# Altium project DARKYDEN.PrjPcb (part 13 of 14)

## Sheet USB2_0_Connector.SchDoc: DARKYDEN_USBC2_0_Connector
size Letter; ApprovedBy: APPROUVÉ PAR; Author: Harold Malbrouck; Organization: Cegep Limoilou; Address1: 1300, 8e Avenue; Address2: Québec, QC; Address3: Canada; Address4: G1J 5L5; Revision: Rev.C; SheetNumber: 22; SheetTotal: 22
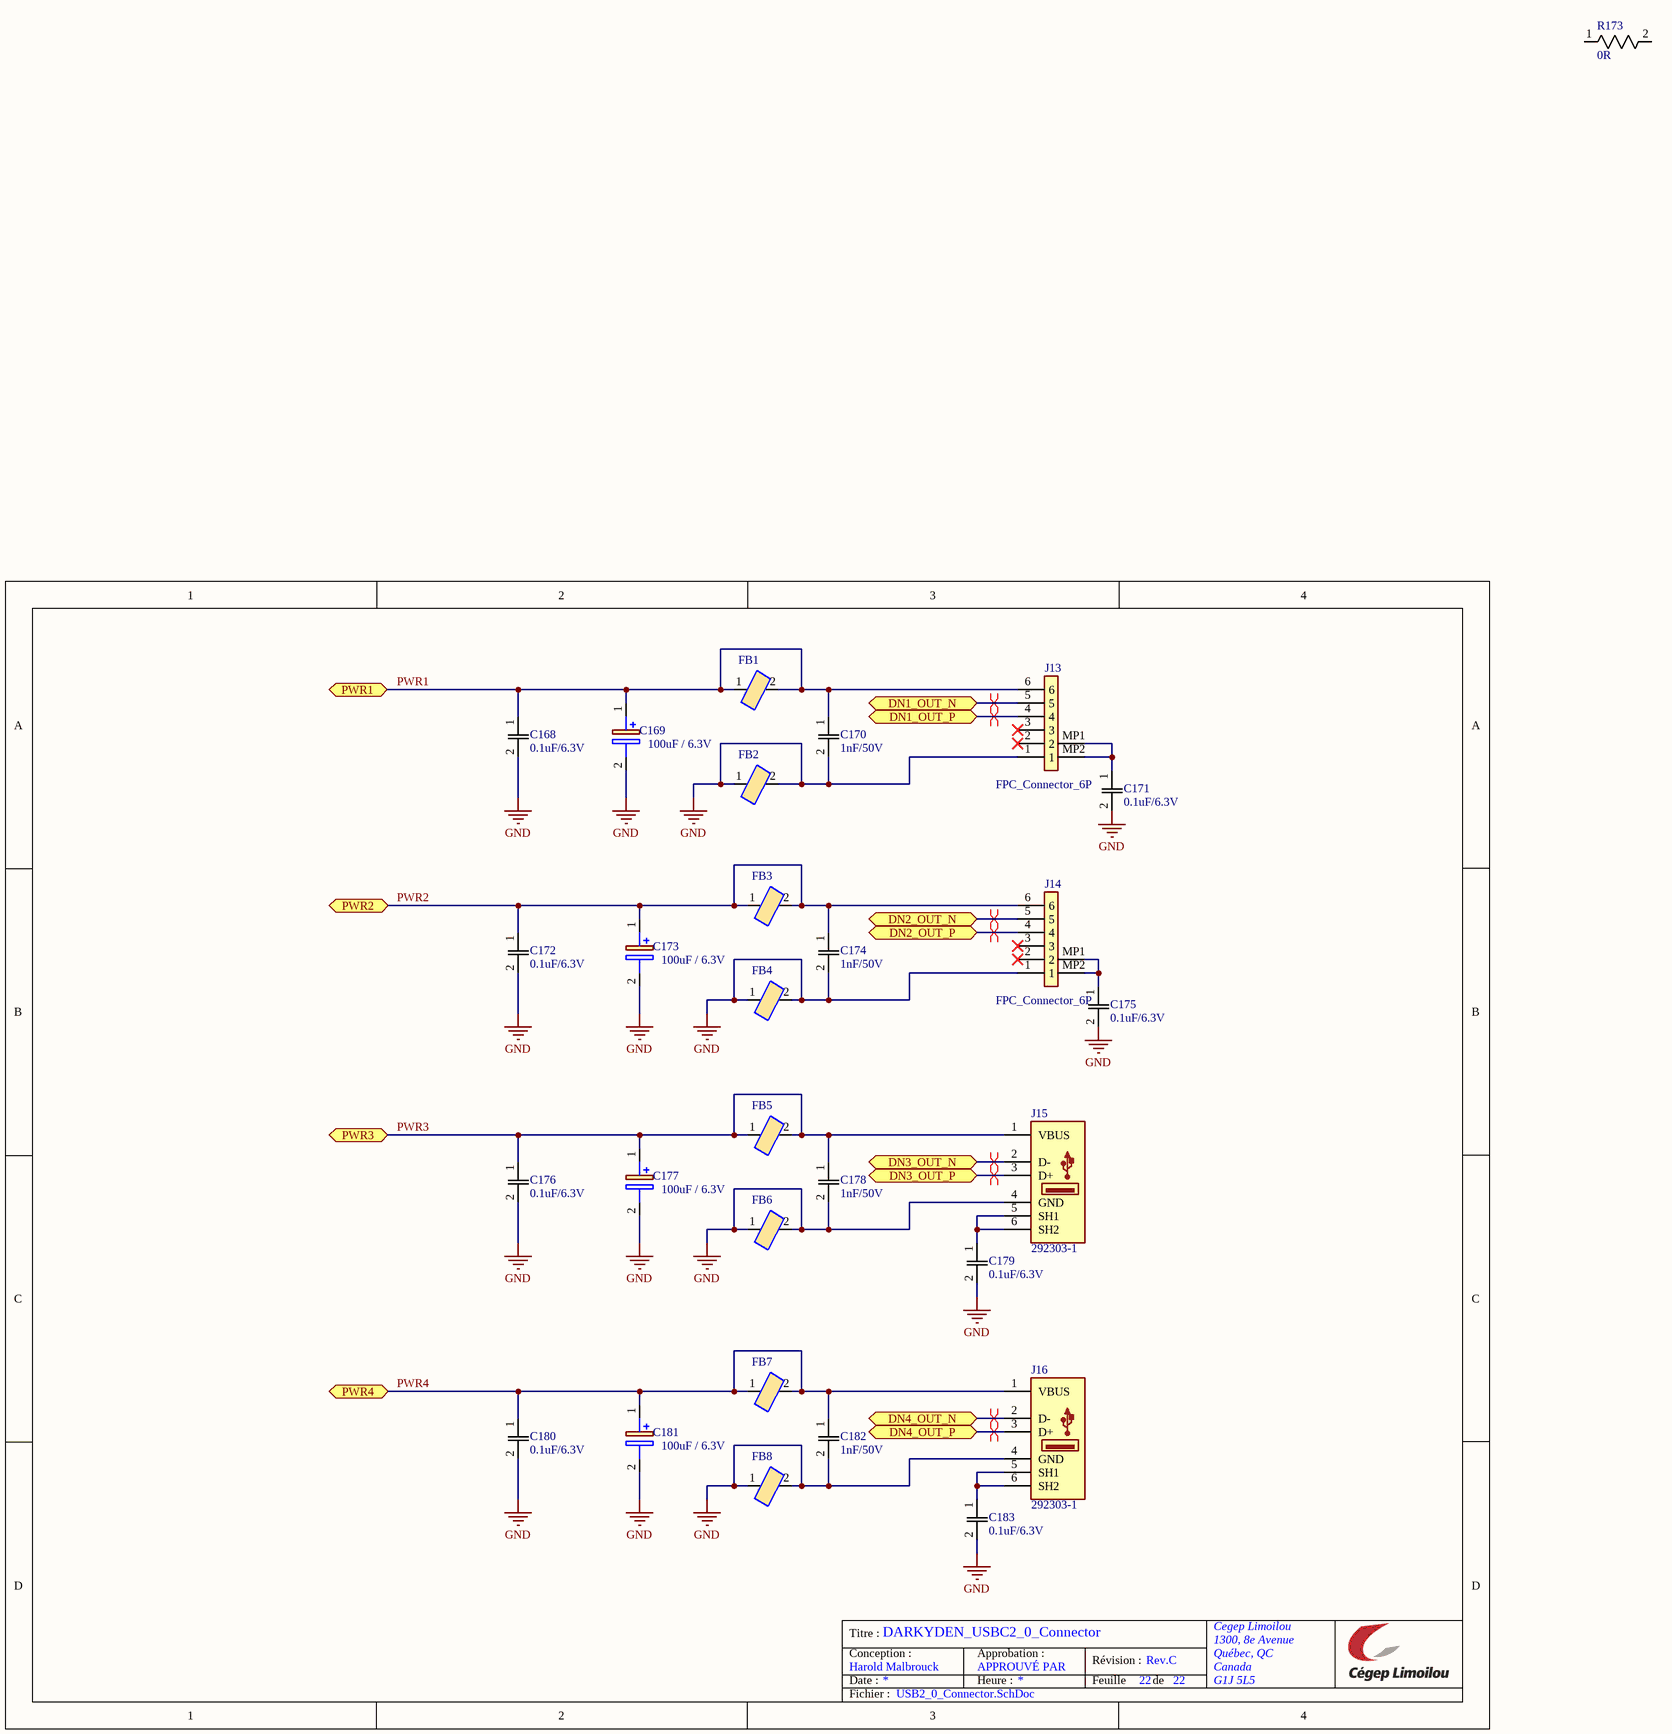
[diagram p14: USB2_0_Connector.SchDoc]

### Parts
C168  0.1uF/6.3V  [C0805]
C169  100uF / 6.3V  [EEE0GA101SR]
C170  1nF/50V  [CAPC2012X88N]
C171  0.1uF/6.3V  [C0805]
C172  0.1uF/6.3V  [C0805]
C173  100uF / 6.3V  [EEE0GA101SR]
C174  1nF/50V  [CAPC2012X88N]
C175  0.1uF/6.3V  [C0805]
C176  0.1uF/6.3V  [C0805]
C177  100uF / 6.3V  [EEE0GA101SR]
C178  1nF/50V  [CAPC2012X88N]
C179  0.1uF/6.3V  [C0805]
C180  0.1uF/6.3V  [C0805]
C181  100uF / 6.3V  [EEE0GA101SR]
C182  1nF/50V  [CAPC2012X88N]
C183  0.1uF/6.3V  [C0805]
FB1  220R / 100MHz  [BLM18SP221SN1B]  (value not drawn)
FB2  220R / 100MHz  [BLM18SP221SN1B]  (value not drawn)
FB3  220R / 100MHz  [BLM18SP221SN1B]  (value not drawn)
FB4  220R / 100MHz  [BLM18SP221SN1B]  (value not drawn)
FB5  220R / 100MHz  [BLM18SP221SN1B]  (value not drawn)
FB6  220R / 100MHz  [BLM18SP221SN1B]  (value not drawn)
FB7  220R / 100MHz  [BLM18SP221SN1B]  (value not drawn)
FB8  220R / 100MHz  [BLM18SP221SN1B]  (value not drawn)
J13  FPC_Connector_6P  [23287026]
J14  FPC_Connector_6P  [23287026]
J15  292303-1  [TECONN-4POS-USB]
J16  292303-1  [TECONN-4POS-USB]
R173  0R  [ERJ3EKF1000V]

### Ports
DN1_OUT_N (bidir, see USB2_0[3C]), DN1_OUT_P (bidir, see USB2_0[3C]), DN2_OUT_N (bidir, see USB2_0[4C]), DN2_OUT_P (bidir, see USB2_0[4C]), DN3_OUT_N (bidir, see USB2_0[2D]), DN3_OUT_P (bidir, see USB2_0[2D]), DN4_OUT_N (bidir, see USB2_0[3D]), DN4_OUT_P (bidir, see USB2_0[3D]), PWR1 (bidir, see USB2_0[2C]), PWR2 (bidir, see USB2_0[3C]), PWR3 (bidir, see USB2_0[1D]), PWR4 (bidir, see USB2_0[3D])

### Nets
GND: C168.2 C169.2(-) C170.2 C171.2 C172.2 C173.2(-) C174.2 C175.2 C176.2 C177.2(-) C178.2 C179.2 C180.2 C181.2(-) C182.2 C183.2 FB2.1 FB2.2 FB4.1 FB4.2 FB6.1 FB6.2 FB8.1 FB8.2 J13.1 J14.1 J15.4(GND) J16.4(GND)  [project net PACK-]
DN1_OUT_N: J13.5 ; port DN1_OUT_N
DN1_OUT_P: J13.4 ; port DN1_OUT_P
DN2_OUT_N: J14.5 ; port DN2_OUT_N
DN2_OUT_P: J14.4 ; port DN2_OUT_P
DN3_OUT_N: J15.2(D-) ; port DN3_OUT_N
DN3_OUT_P: J15.3(D+) ; port DN3_OUT_P
DN4_OUT_N: J16.2(D-) ; port DN4_OUT_N
DN4_OUT_P: J16.3(D+) ; port DN4_OUT_P
PWR1: C168.1 C169.1(+) C170.1 FB1.1 FB1.2 J13.6 ; port PWR1
PWR2: C172.1 C173.1(+) C174.1 FB3.1 FB3.2 J14.6 ; port PWR2
PWR3: C176.1 C177.1(+) C178.1 FB5.1 FB5.2 J15.1(VBUS) ; port PWR3
PWR4: C180.1 C181.1(+) C182.1 FB7.1 FB7.2 J16.1(VBUS) ; port PWR4
NetC171_1: C171.1 J13.MP1 J13.MP2
NetC175_1: C175.1 J14.MP1 J14.MP2
NetC179_1: C179.1 J15.5(SH1) J15.6(SH2)
NetC183_1: C183.1 J16.5(SH1) J16.6(SH2)

Not connected (* = marked no-connect by the designer): J13 2* 3*; J14 2* 3*; R173 1 2

### Layout directives
differential pair: DN1_OUT_N, DN1_OUT_P, DN2_OUT_N, DN2_OUT_P, DN3_OUT_N, DN3_OUT_P, DN4_OUT_N, DN4_OUT_P

### Notes on the sheet
- Titre :
- Conception :
- Date :
- Approbation :
- Heure :
- Révision :
- Feuille
- de
- Fichier :

### Library data of the parts
C168 C171 C172 C175 C176 C179 C180 C183 = C0805C104K9RACTU: as C156 on sheet USB2_0; Datasheet Link: https://content.kemet.com/datasheets/KEM_C1002_X7R_SMD.pdf; Height: 1.1mm; Manufacturer_Part_Number: C0805C104K9RACTU; Mouser Part Number: 80-C0805C104K9R; Mouser Price/Stock: https://www.mouser.co.uk/ProductDetail/KEMET/C0805C104K9RACTU?qs=jbCUrP3sAgRYLjBU7s5h8Q%3D%3D; Arrow Part Number: C0805C104K9RACTU; Arrow Price/Stock: https://www.arrow.com/en/products/c0805c104k9ractu/kemet-corporation; Supplier: Digikey; Supplier Part Number: 399-C0805C104K9RACTUCT-ND; Manufacturer: KEMET; Manufacturer Part Number: C0805C104K9RACTU; RoHS: Yes; Category: Ceramic Capacitors; Stock: 68008; Pricing: 1=0.21, 10=0.214, 100=0.1506, 1000=0.11154 (USD); Mounting Technology: Surface Mount; Case/Package: 0805; Case Code (Metric): 2012; Case Code (Imperial): 0805; Min Operating Temperature: -55°C; Max Operating Temperature: 125°C; Package Quantity: 4000; Voltage Rating: 6.3V; Tolerance: 10%; Packaging: Tape and Reel; Voltage Rating (DC): 6.3V; Dielectric: X7R; Termination: SMD/SMT; Series: SMD Comm X7R; Construction: Flat; Length: 2mm; Width: 1.2mm; Thickness: 0.039inch; Depth: 1.25mm; Radiation Hardening: No; RoHS Compliant: Yes; ComponentLink1URL: http://www.farnell.com/datasheets/2746329.pdf?src-supplier=Farnell; ComponentLink1Description: http://www.farnell.com/datasheets/2746329.pdf?src-supplier=Farnell; ComponentLink2URL: http://www.mouser.com/ds/2/212/KEM_C1002_X7R_SMD-1102033.pdf?src-supplier=Mouser; ComponentLink2Description: http://www.mouser.com/ds/2/212/KEM_C1002_X7R_SMD-1102033.pdf?src-supplier=Mouser; ComponentLink3URL: http://datasheet.octopart.com/C0805C104K9RACTU-KEMET-datasheet-157246124.pdf?src-supplier=Avnet; ComponentLink3Description: http://datasheet.octopart.com/C0805C104K9RACTU-KEMET-datasheet-157246124.pdf?src-supplier=Avnet; ComponentLink4URL: http://datasheet.octopart.com/C0805C104K9RACTU-KEMET-datasheet-157246124.pdf?src-supplier=Onlinecomponents.com; ComponentLink4Description: http://datasheet.octopart.com/C0805C104K9RACTU-KEMET-datasheet-157246124.pdf?src-supplier=Onlinecomponents.com; ComponentLink5URL: http://capacitoredge.kemet.com/capedge2/DataSheet?pn=C0805C104K9RACTU&src-supplier=Avnet; ComponentLink5Description: http://capacitoredge.kemet.com/capedge2/DataSheet?pn=C0805C104K9RACTU&src-supplier=Avnet; ComponentLink6URL: http://www.farnell.com/datasheets/2746329.pdf?src-supplier=Newark; ComponentLink6Description: http://www.farnell.com/datasheets/2746329.pdf?src-supplier=Newark; ComponentLink7URL: http://datasheet.octopart.com/C0805C104K9RACTU-KEMET-datasheet-157246124.pdf?src-supplier=Digikey; ComponentLink7Description: http://datasheet.octopart.com/C0805C104K9RACTU-KEMET-datasheet-157246124.pdf?src-supplier=Digikey; ComponentLink8URL: https://api.kemet.com/component-edge/download/datasheet/C0805C104K9RACTU.pdf?src-supplier=Digikey; ComponentLink8Description: https://api.kemet.com/component-edge/download/datasheet/C0805C104K9RACTU.pdf?src-supplier=Digikey; ComponentLink9URL: https://datasheet.octopart.com/C0805C104K9RACTU.-KEMET-datasheet-179056791.pdf?src-supplier=Element14; ComponentLink9Description: https://datasheet.octopart.com/C0805C104K9RACTU.-KEMET-datasheet-179056791.pdf?src-supplier=Element14; ComponentLink10URL: https://datasheet.octopart.com/C0805C104K9RACTU-KEMET-datasheet-137357759.pdf?src-supplier=Farnell; ComponentLink10Description: https://datasheet.octopart.com/C0805C104K9RACTU-KEMET-datasheet-137357759.pdf?src-supplier=Farnell; ComponentLink11URL: http://www.farnell.com/datasheets/2746329.pdf?src-supplier=Element14; ComponentLink11Description: http://www.farnell.com/datasheets/2746329.pdf?src-supplier=Element14; ComponentLink12URL: https://datasheet.octopart.com/C0805C104K9RACTU-KEMET-datasheet-157246124.pdf?src-supplier=TME; ComponentLink12Description: https://datasheet.octopart.com/C0805C104K9RACTU-KEMET-datasheet-157246124.pdf?src-supplier=TME; ComponentLink13URL: http://datasheet.octopart.com/C0805C104K9RACTU-KEMET-datasheet-157246124.pdf?src-supplier=TTI; ComponentLink13Description: http://datasheet.octopart.com/C0805C104K9RACTU-KEMET-datasheet-157246124.pdf?src-supplier=TTI; ComponentLink14URL: http://datasheet.octopart.com/C0805C104K9RACTU-KEMET-datasheet-157246124.pdf?src-supplier=Electro+Sonic; ComponentLink14Description: http://datasheet.octopart.com/C0805C104K9RACTU-KEMET-datasheet-157246124.pdf?src-supplier=Electro+Sonic
C169 C173 C177 C181 = EEE-FPJ101UAR: 100uF 6.3V 20% Cap Aluminum Lytic  SMD 0.36 Ohm 240mA 2000h 105C Automotive T/R; Manufacturer_Name: Panasonic; Material: Aluminium; ESR (Equivalent Series Resistance): 360mR; Life (Hours): 2000Hour; Leakage Current: 6.3uA; Datasheet Link: http://industrial.panasonic.com/cdbs/www-data/pdf/RDE0000/ABA0000C1184.pdf; Height: 6.5mm; Manufacturer_Part_Number: EEE-FPJ101UAR; Mouser Part Number: 667-EEE-FPJ101UAR; Mouser Price/Stock: https://www.mouser.co.uk/ProductDetail/Panasonic/EEE-FPJ101UAR?qs=d1CqaRUMZD%252BxJy4M83vA9g%3D%3D; Arrow Part Number: EEE-FPJ101UAR; Arrow Price/Stock: https://www.arrow.com/en/products/eee-fpj101uar/panasonic?utm_currency=USD&region=europe; Supplier: Digikey; Supplier Part Number: PCE4514CT-ND; Manufacturer: Panasonic; Manufacturer Part Number: EEE-FPJ101UAR; RoHS: Yes; Category: Aluminum Electrolytic Capacitors; Stock: 28785; Pricing: 1=0.56, 10=0.35, 50=0.2602, 100=0.2317, 500=0.18256 (USD); Mounting Technology: Surface Mount,PCB; Case/Package: Radial; Dielectric Material: Aluminium; Min Operating Temperature: -55°C; Max Operating Temperature: 105°C; Value: 100uF; Packaging: Tape and Reel; Voltage Rating (DC): 6.3V; Package Quantity: 1; Termination: SMD/SMT; Series: FP; Ripple Current: 240mA; Tolerance: 20%; Voltage Rating: 6.3V; Ripple Current (AC): 240mA; Voltage: 6.3V; Construction: Cylindrical; Diameter: 5mm; Length: 6.1mm; Lead Pitch: 1.5mm; Height - Seated (Max): 0.228inch; Radiation Hardening: No; Lead Free: Lead Free; RoHS Compliant: Yes; Reach SVHC Compliant: Unknown; ComponentLink1URL: https://datasheet.ciiva.com/11777/0900766b80df09a1-11777260.pdf?src-supplier=Rs; ComponentLink1Description: https://datasheet.ciiva.com/11777/0900766b80df09a1-11777260.pdf?src-supplier=Rs; ComponentLink2URL: https://datasheet.ciiva.com/25614/0900766b80df09a1-25614042.pdf?src-supplier=Rs; ComponentLink2Description: https://datasheet.ciiva.com/25614/0900766b80df09a1-25614042.pdf?src-supplier=Rs; ComponentLink3URL: https://datasheet.ciiva.com/2985/aba0000ce114-2985560.pdf?src-supplier=Avnet; ComponentLink3Description: https://datasheet.ciiva.com/2985/aba0000ce114-2985560.pdf?src-supplier=Avnet; ComponentLink4URL: https://datasheet.ciiva.com/30259/aba0000ce114-30259452.pdf?src-supplier=Onlinecomponents.com; ComponentLink4Description: https://datasheet.ciiva.com/30259/aba0000ce114-30259452.pdf?src-supplier=Onlinecomponents.com; ComponentLink5URL: https://datasheet.ciiva.com/14597/70068195-14597061.pdf?src-supplier=Allied+Electronics; ComponentLink5Description: https://datasheet.ciiva.com/14597/70068195-14597061.pdf?src-supplier=Allied+Electronics; ComponentLink6URL: https://datasheet.ciiva.com/14606/70068195-14606383.pdf?src-supplier=Allied+Electronics; ComponentLink6Description: https://datasheet.ciiva.com/14606/70068195-14606383.pdf?src-supplier=Allied+Electronics; ComponentLink7URL: https://datasheet.ciiva.com/48523/fp-eng-tds-48523719.pdf?src-supplier=Distrelec; ComponentLink7Description: https://datasheet.ciiva.com/48523/fp-eng-tds-48523719.pdf?src-supplier=Distrelec; ComponentLink8URL: https://datasheet.ciiva.com/46391/370232-46391160.pdf?src-supplier=Element14; ComponentLink8Description: https://datasheet.ciiva.com/46391/370232-46391160.pdf?src-supplier=Element14; ComponentLink9URL: https://datasheet.ciiva.com/46398/370232-46398005.pdf?src-supplier=Element14; ComponentLink9Description: https://datasheet.ciiva.com/46398/370232-46398005.pdf?src-supplier=Element14
C170 C174 C178 C182 = C0805C102K5RAC-TU: 1000 pF ±10% 50V Ceramic Capacitor X7R 0805 (2012 Metric); Manufacturer_Name: KEMET; Datasheet Link: https://componentsearchengine.com/Datasheets/2/C0805C102K5RAC-TU.pdf; Height: 0.88mm; Manufacturer_Part_Number: C0805C102K5RAC-TU
FB1-FB8 = BLM18EG221SN1D: Ferrite Beads Multi-Layer 220Ohm 25% 100MHz 2A 50mOhm DCR 0603 Paper T/R; Manufacturer_Name: Murata Electronics; Manufacturer: Murata; Material: Steel,Ferrite; Value: 50mR; Number of Lines: 1; Number of Circuits: 1NUMBER; Datasheet Link: http://www.murata.com/~/media/webrenewal/support/library/catalog/products/emc/emifil/c31e.ashx?la=en-gb; Height: 0.95mm; Manufacturer_Part_Number: BLM18EG221SN1D; Mouser Part Number: 81-BLM18EG221SN1D; Mouser Price/Stock: https://www.mouser.co.uk/ProductDetail/Murata-Electronics/BLM18EG221SN1D?qs=uSeJpk%2F8In2DDeSj2a4KGA%3D%3D; Arrow Part Number: BLM18EG221SN1D; Arrow Price/Stock: https://www.arrow.com/en/products/blm18eg221sn1d/murata-manufacturing?utm_currency=USD&region=nac; Supplier: Digikey; Supplier Part Number: 490-3992-1-ND; Manufacturer Part Number: BLM18EG221SN1D; RoHS: Yes; Category: Ferrite Beads and Chips; Stock: 133283; Pricing: 1=0.24, 10=0.167, 25=0.1444, 50=0.1292, 100=0.1154, 250=0.09864, 500=0.08708, 1000=0.07636 (USD); Case/Package: 0603; Pins: 2; Core Material: Ferrite; Case Code (Metric): 1608; Case Code (Imperial): 0603; Min Operating Temperature: -55°C; Max Operating Temperature: 125°C; Tolerance: 25%; Impedance: 220R; Package Quantity: 1; Packaging: Tape and Reel; Current Rating: 2A; Max Current Rating: 2A; DC Resistance (DCR): 50mR; Max DC Current: 2A; Termination: SMD/SMT; Test Frequency: 100MHz; DC Current: 2A; Series: BLM18E; DC Resistance-Max: 50mR; RMS Current (Irms): 2A; ESR: 50mR; Frequency: 100MHz; Length: 1.6mm; Width: 0.8mm; Depth: 0.8mm; Radiation Hardening: No; Reach SVHC Compliant: No; Military Standard: Not; Lead Free: Lead Free; RoHS Compliant: Yes; ComponentLink1URL: https://datasheet.ciiva.com/11799/0900766b811b5866-11799010.pdf?src-supplier=Rs; ComponentLink1Description: https://datasheet.ciiva.com/11799/0900766b811b5866-11799010.pdf?src-supplier=Rs; ComponentLink2URL: https://datasheet.ciiva.com/41449/001171699-da-01-en-chip-drossel0603-220r-2000ma-1-6x0-8mm-41449376.pdf?src-supplier=Conrad; ComponentLink2Description: https://datasheet.ciiva.com/41449/001171699-da-01-en-chip-drossel0603-220r-2000ma-1-6x0-8mm-41449376.pdf?src-supplier=Conrad; ComponentLink3URL: https://datasheet.ciiva.com/41449/001172265-da-01-en-drossel-0603-220r-1-6x0-8mm-4000st-41449579.pdf?src-supplier=Conrad; ComponentLink3Description: https://datasheet.ciiva.com/41449/001172265-da-01-en-drossel-0603-220r-1-6x0-8mm-4000st-41449579.pdf?src-supplier=Conrad; ComponentLink4URL: https://datasheet.ciiva.com/1012/l0110s0101blm18e-1012872.pdf?src-supplier=Digikey; ComponentLink4Description: https://datasheet.ciiva.com/1012/l0110s0101blm18e-1012872.pdf?src-supplier=Digikey; ComponentLink5URL: https://datasheet.ciiva.com/1012/l0110s0101blm18e-1012873.pdf?src-supplier=Digikey; ComponentLink5Description: https://datasheet.ciiva.com/1012/l0110s0101blm18e-1012873.pdf?src-supplier=Digikey; ComponentLink6URL: https://datasheet.ciiva.com/1012/l0110s0101blm18e-1012874.pdf?src-supplier=Digikey; ComponentLink6Description: https://datasheet.ciiva.com/1012/l0110s0101blm18e-1012874.pdf?src-supplier=Digikey; ComponentLink7URL: https://datasheet.ciiva.com/14122/blm-series-eng-tds-14122908.pdf?src-supplier=Distrelec; ComponentLink7Description: https://datasheet.ciiva.com/14122/blm-series-eng-tds-14122908.pdf?src-supplier=Distrelec; ComponentLink8URL: https://datasheet.ciiva.com/1467/5169-1467157.pdf?src-supplier=Element14; ComponentLink8Description: https://datasheet.ciiva.com/1467/5169-1467157.pdf?src-supplier=Element14; ComponentLink9URL: https://datasheet.ciiva.com/1467/5169-1467158.pdf?src-supplier=Element14; ComponentLink9Description: https://datasheet.ciiva.com/1467/5169-1467158.pdf?src-supplier=Element14; ComponentLink10URL: https://datasheet.ciiva.com/8510/l0110s0101blm18e-8510140.pdf?src-supplier=Avnet; ComponentLink10Description: https://datasheet.ciiva.com/8510/l0110s0101blm18e-8510140.pdf?src-supplier=Avnet; ComponentLink11URL: https://datasheet.ciiva.com/16419/l0110s0101blm18e-16419148.pdf?src-supplier=Future+Electronics; ComponentLink11Description: https://datasheet.ciiva.com/16419/l0110s0101blm18e-16419148.pdf?src-supplier=Future+Electronics
J13 J14 = 2328702-6: FPC Connector; 0.5mm pitch dual contact back flip FPC, 6pos | TE Connectivity 2328702-6; Actuator Material: Thermoplastic; Actuator Color: Black; Number of Positions: 6; Voltage Rating: 50V; Current Rating: 500mA; Value: 7.6pF; Datasheet Link: https://www.te.com/commerce/DocumentDelivery/DDEController?Action=srchrtrv&DocNm=1-1773959-7-FPC-Connectors-CN&DocType=Data%20Sheet&DocLang=Chinese (Simplified)&PartCntxt=2328702-6&DocFormat=pdf; Height: 1.1mm; Manufacturer_Name: TE Connectivity; Manufacturer_Part_Number: 2328702-6; Mouser Part Number: 571-2328702-6; Mouser Price/Stock: https://www.mouser.co.uk/ProductDetail/TE-Connectivity/2328702-6?qs=w%2Fv1CP2dgqrAQsCHQ2ClBQ%3D%3D; Arrow Part Number: 2328702-6; Arrow Price/Stock: https://www.arrow.com/en/products/2328702-6/te-connectivity?utm_currency=USD&region=nac; Supplier: Digikey; Supplier Part Number: A141388CT-ND; Manufacturer: TE Connectivity; Manufacturer Part Number: 2328702-6; RoHS: Yes; Category: FFC / FPC; Stock: 48490; Pricing: 1=0.19, 10=0.162, 25=0.1512, 50=0.144, 100=0.1372, 250=0.12856, 500=0.12242, 1000=0.11657 (USD); Mounting Technology: Surface Mount; Case/Package: 0402; Contact Material: Copper Alloy; Contact Plating: Gold; Housing Material: Thermoplastic; Housing Color: Natural; Min Operating Temperature: -40°C; Max Operating Temperature: 85°C; Packaging: Cut Tape; Termination: Solder; Series: -; Ratings: AEC-Q200; Flammability Rating: UL94 V-0; ComponentLink1URL: https://www.te.com/commerce/DocumentDelivery/DDEController?Action=srchrtrv&amp;DocNm=2328702&amp;DocType=Customer+Drawing&amp;DocLang=English&src-supplier=Digikey; ComponentLink1Description: https://www.te.com/commerce/DocumentDelivery/DDEController?Action=srchrtrv&amp;DocNm=2328702&amp;DocType=Customer+Drawing&amp;DocLang=English&src-supplier=Digikey; ComponentLink2URL: https://www.te.com/commerce/DocumentDelivery/DDEController?Action=srchrtrv&DocNm=2328702&DocType=Customer+Drawing&DocLang=English&src-supplier=Digikey; ComponentLink2Description: https://www.te.com/commerce/DocumentDelivery/DDEController?Action=srchrtrv&DocNm=2328702&DocType=Customer+Drawing&DocLang=English&src-supplier=Digikey; ComponentLink3URL: https://datasheet.octopart.com/2328702-6-TE-Connectivity-datasheet-137167967.pdf?src-supplier=Electro+Sonic; ComponentLink3Description: https://datasheet.octopart.com/2328702-6-TE-Connectivity-datasheet-137167967.pdf?src-supplier=Electro+Sonic
J15 J16 = 292303-1: USB-A (USB TYPE-A) USB 2.0 Receptacle Connector 4 Position Through Hole, Right Angle; Manufacturer_Name: TE Connectivity; Datasheet Link: https://datasheet.datasheetarchive.com/originals/distributors/Datasheets_SAMA/3e4c4de204b167d1a9250e6de251b7b8.pdf; Manufacturer_Part_Number: 292303-1; Mouser Part Number: 571-292303-1; Mouser Price/Stock: https://www.mouser.co.uk/ProductDetail/TE-Connectivity/292303-1?qs=G%2F5vCLrg9vx2OsUPTgR%2F%252BQ%3D%3D; Arrow Part Number: 292303-1; Arrow Price/Stock: https://www.arrow.com/en/products/292303-1/te-connectivity?region=europe
R173 = ERJ-3GEY0R00V: as R159 on sheet USB2_0; Datasheet Link: http://docs-europe.electrocomponents.com/webdocs/13ba/0900766b813ba21b.pdf; Height: 0.55mm; Manufacturer_Part_Number: ERJ-3GEY0R00V; Mouser Part Number: 667-ERJ-3GEY0R00V; Mouser Price/Stock: https://www.mouser.co.uk/ProductDetail/Panasonic/ERJ-3GEY0R00V?qs=66DK8nO8gJALIOqOWgiVwg%3D%3D; Arrow Part Number: ERJ-3GEY0R00V; Arrow Price/Stock: https://www.arrow.com/en/products/erj3gey0r00v/panasonic?region=europe; Supplier: Digikey; Supplier Part Number: P0.0GCT-ND; Manufacturer: Panasonic; Manufacturer Part Number: ERJ-3GEY0R00V; RoHS: Yes; Category: Chip SMD Resistors; Stock: 766631; Pricing: 1=0.1, 10=0.02, 25=0.0164, 50=0.0144, 100=0.0126, 250=0.0106, 500=0.00936, 1000=0.0083 (USD); Mounting Technology: Surface Mount; Case/Package: 0603; Case Code (Metric): 1608; Case Code (Imperial): 0603; Contact Plating: Tin; Min Operating Temperature: -55°C; Max Operating Temperature: 155°C; Packaging: Tape and Reel; Package Quantity: 5000; Value: 0R; Resistor Type: Thick Film; Number of Terminations: 2; Termination: SMD/SMT; Max Power Dissipation: 100mW; Features: Automotive AEC-Q200; Series: ERJ; Construction: Rectangular; Technology: THICK FILM; Length: 1.6mm; Width: 0.8mm; Depth: 0.8mm; Ratings: AEC-Q200; Radiation Hardening: No; Reach SVHC Compliant: No; Military Standard: Not; RoHS Compliant: Yes; Lead Free: 5697LeadFree; ComponentLink1URL: https://datasheet.ciiva.com/11808/0900766b80f806dd-11808207.pdf?src-supplier=Rs; ComponentLink1Description: https://datasheet.ciiva.com/11808/0900766b80f806dd-11808207.pdf?src-supplier=Rs; ComponentLink2URL: https://datasheet.ciiva.com/27055/1935748-27055113.pdf?src-supplier=Jameco; ComponentLink2Description: https://datasheet.ciiva.com/27055/1935748-27055113.pdf?src-supplier=Jameco; ComponentLink3URL: https://datasheet.ciiva.com/5959/1678796-5959707.pdf?src-supplier=Farnell; ComponentLink3Description: https://datasheet.ciiva.com/5959/1678796-5959707.pdf?src-supplier=Farnell; ComponentLink4URL: https://datasheet.ciiva.com/43460/1678796-43460647.pdf?src-supplier=Farnell; ComponentLink4Description: https://datasheet.ciiva.com/43460/1678796-43460647.pdf?src-supplier=Farnell; ComponentLink5URL: https://datasheet.ciiva.com/48532/aoa0000ce1-48532165.pdf?src-supplier=Avnet; ComponentLink5Description: https://datasheet.ciiva.com/48532/aoa0000ce1-48532165.pdf?src-supplier=Avnet; ComponentLink6URL: https://datasheet.ciiva.com/28695/1678796-28695833.pdf?src-supplier=Element14; ComponentLink6Description: https://datasheet.ciiva.com/28695/1678796-28695833.pdf?src-supplier=Element14; ComponentLink7URL: https://datasheet.ciiva.com/16834/aoa0000ce1-16834828.pdf?src-supplier=Future+Electronics; ComponentLink7Description: https://datasheet.ciiva.com/16834/aoa0000ce1-16834828.pdf?src-supplier=Future+Electronics; ComponentLink8URL: https://datasheet.ciiva.com/16758/70255313-16758527.pdf?src-supplier=Allied+Electronics; ComponentLink8Description: https://datasheet.ciiva.com/16758/70255313-16758527.pdf?src-supplier=Allied+Electronics; ComponentLink9URL: https://datasheet.ciiva.com/30199/4aoa0000ce1-30199822.pdf?src-supplier=Onlinecomponents.com; ComponentLink9Description: https://datasheet.ciiva.com/30199/4aoa0000ce1-30199822.pdf?src-supplier=Onlinecomponents.com; ComponentLink10URL: https://datasheet.ciiva.com/46377/1678796-46377868.pdf?src-supplier=Element14; ComponentLink10Description: https://datasheet.ciiva.com/46377/1678796-46377868.pdf?src-supplier=Element14; ComponentLink11URL: https://datasheet.ciiva.com/9198/aoa0000ce1-9198975.pdf?src-supplier=Avnet; ComponentLink11Description: https://datasheet.ciiva.com/9198/aoa0000ce1-9198975.pdf?src-supplier=Avnet